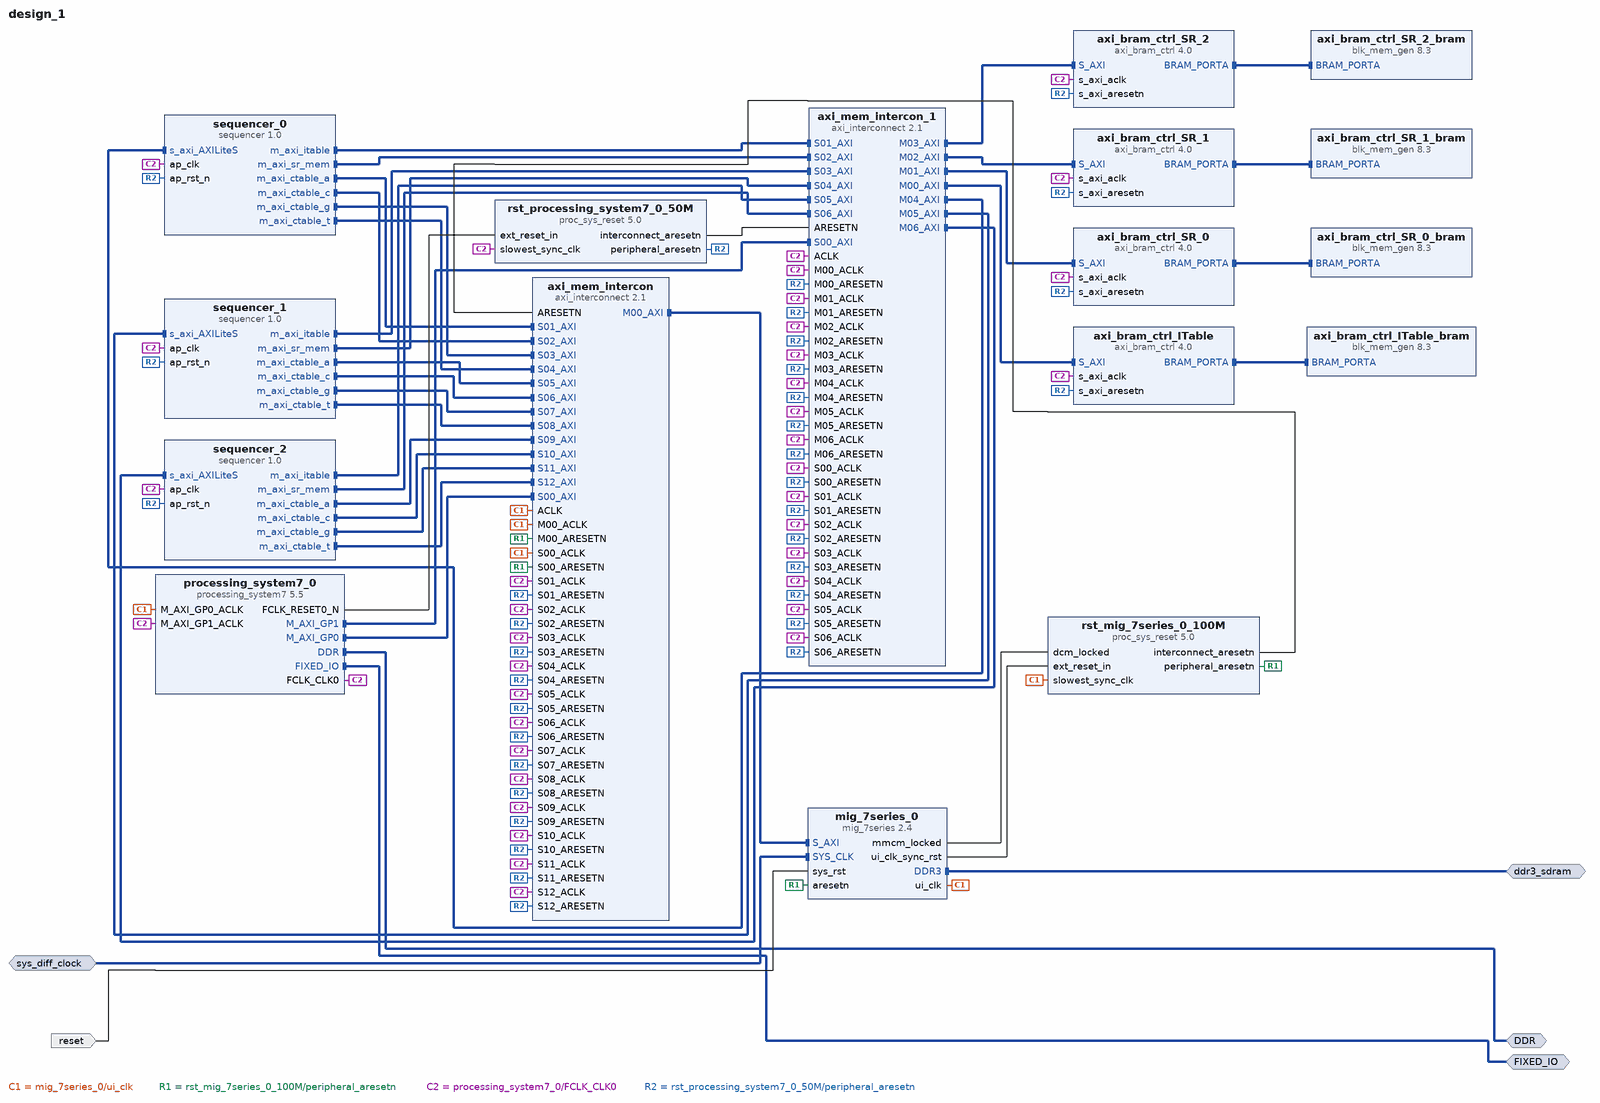
[diagram p0: block diagram of the top level]
# Vivado block design design_1, Vivado 2015.4
create_bd_design design_1

create_bd_intf_port -mode Master -vlnv xilinx.com:interface:ddrx_rtl:1.0 DDR
create_bd_intf_port -mode Master -vlnv xilinx.com:display_processing_system7:fixedio_rtl:1.0 FIXED_IO
create_bd_intf_port -mode Master -vlnv xilinx.com:interface:ddrx_rtl:1.0 ddr3_sdram
create_bd_intf_port -mode Slave -vlnv xilinx.com:interface:diff_clock_rtl:1.0 sys_diff_clock
set_property -dict {CONFIG.FREQ_HZ 100000000} [get_bd_intf_ports sys_diff_clock]
create_bd_port -dir I -type rst reset
set_property -dict {CONFIG.POLARITY ACTIVE_HIGH} [get_bd_ports reset]

create_bd_cell -type ip -vlnv xilinx.com:ip:processing_system7:5.5 processing_system7_0
set_property -dict [list \
  CONFIG.PCW_UIPARAM_DDR_FREQ_MHZ 533.333313 \
  CONFIG.PCW_APU_PERIPHERAL_FREQMHZ 667.000000 \
  CONFIG.PCW_SDIO_PERIPHERAL_FREQMHZ 50 \
  CONFIG.PCW_UART_PERIPHERAL_FREQMHZ 50 \
  CONFIG.PCW_USE_M_AXI_GP1 1 \
  CONFIG.PCW_PRESET_BANK0_VOLTAGE {LVCMOS 1.8V} \
  CONFIG.PCW_PRESET_BANK1_VOLTAGE {LVCMOS 1.8V} \
  CONFIG.PCW_UIPARAM_DDR_PARTNO Custom \
  CONFIG.PCW_QSPI_PERIPHERAL_ENABLE 1 \
  CONFIG.PCW_QSPI_GRP_SINGLE_SS_ENABLE 1 \
  CONFIG.PCW_QSPI_GRP_FBCLK_ENABLE 1 \
  CONFIG.PCW_ENET0_PERIPHERAL_ENABLE 1 \
  CONFIG.PCW_ENET0_ENET0_IO {MIO 16 .. 27} \
  CONFIG.PCW_ENET0_GRP_MDIO_ENABLE 1 \
  CONFIG.PCW_ENET0_GRP_MDIO_IO {MIO 52 .. 53} \
  CONFIG.PCW_ENET0_RESET_ENABLE 1 \
  CONFIG.PCW_ENET0_RESET_IO {MIO 47} \
  CONFIG.PCW_SD0_PERIPHERAL_ENABLE 1 \
  CONFIG.PCW_SD0_GRP_CD_ENABLE 1 \
  CONFIG.PCW_SD0_GRP_CD_IO {MIO 14} \
  CONFIG.PCW_SD0_GRP_WP_ENABLE 1 \
  CONFIG.PCW_UART1_PERIPHERAL_ENABLE 1 \
  CONFIG.PCW_WDT_PERIPHERAL_ENABLE 1 \
  CONFIG.PCW_TTC0_PERIPHERAL_ENABLE 1 \
  CONFIG.PCW_USB0_PERIPHERAL_ENABLE 1 \
  CONFIG.PCW_USB0_RESET_ENABLE 1 \
  CONFIG.PCW_USB0_RESET_IO {MIO 7} \
  CONFIG.PCW_I2C0_PERIPHERAL_ENABLE 1 \
  CONFIG.PCW_I2C0_I2C0_IO {MIO 50 .. 51} \
  CONFIG.PCW_I2C0_RESET_ENABLE 1 \
  CONFIG.PCW_I2C0_RESET_IO {MIO 46} \
  CONFIG.PCW_GPIO_MIO_GPIO_ENABLE 1 \
] [get_bd_cells processing_system7_0]
# 155 more settings of processing_system7_0 are not shown: defaults, MIO pin electricals, DDR timing, and values the tool derives
create_bd_cell -type ip -vlnv xilinx.com:ip:mig_7series:2.4 mig_7series_0
set_property -dict {CONFIG.RESET_BOARD_INTERFACE reset CONFIG.BOARD_MIG_PARAM ddr3_sdram} [get_bd_cells mig_7series_0]
create_bd_cell -type ip -vlnv xilinx.com:ip:axi_interconnect:2.1 axi_mem_intercon
set_property -dict {CONFIG.NUM_SI 13 CONFIG.NUM_MI 1} [get_bd_cells axi_mem_intercon]
create_bd_cell -type ip -vlnv xilinx.com:ip:proc_sys_reset:5.0 rst_mig_7series_0_100M
create_bd_cell -type ip -vlnv xilinx.com:ip:axi_bram_ctrl:4.0 axi_bram_ctrl_ITable
set_property -dict {CONFIG.SINGLE_PORT_BRAM 1} [get_bd_cells axi_bram_ctrl_ITable]
create_bd_cell -type ip -vlnv xilinx.com:ip:axi_interconnect:2.1 axi_mem_intercon_1
set_property -dict {CONFIG.NUM_SI 7 CONFIG.NUM_MI 7} [get_bd_cells axi_mem_intercon_1]
create_bd_cell -type ip -vlnv xilinx.com:ip:proc_sys_reset:5.0 rst_processing_system7_0_50M
create_bd_cell -type ip -vlnv xilinx.com:ip:blk_mem_gen:8.3 axi_bram_ctrl_ITable_bram
create_bd_cell -type ip -vlnv xilinx.com:ip:axi_bram_ctrl:4.0 axi_bram_ctrl_SR_0
set_property -dict {CONFIG.SINGLE_PORT_BRAM 1} [get_bd_cells axi_bram_ctrl_SR_0]
create_bd_cell -type ip -vlnv xilinx.com:ip:axi_bram_ctrl:4.0 axi_bram_ctrl_SR_1
set_property -dict {CONFIG.SINGLE_PORT_BRAM 1} [get_bd_cells axi_bram_ctrl_SR_1]
create_bd_cell -type ip -vlnv xilinx.com:ip:axi_bram_ctrl:4.0 axi_bram_ctrl_SR_2
set_property -dict {CONFIG.SINGLE_PORT_BRAM 1} [get_bd_cells axi_bram_ctrl_SR_2]
create_bd_cell -type ip -vlnv xilinx.com:ip:blk_mem_gen:8.3 axi_bram_ctrl_SR_0_bram
create_bd_cell -type ip -vlnv xilinx.com:ip:blk_mem_gen:8.3 axi_bram_ctrl_SR_1_bram
create_bd_cell -type ip -vlnv xilinx.com:ip:blk_mem_gen:8.3 axi_bram_ctrl_SR_2_bram
create_bd_cell -type ip -vlnv xilinx.com:hls:sequencer:1.0 sequencer_0
create_bd_cell -type ip -vlnv xilinx.com:hls:sequencer:1.0 sequencer_1
create_bd_cell -type ip -vlnv xilinx.com:hls:sequencer:1.0 sequencer_2

# ---- connections ----

connect_bd_intf_net [get_bd_intf_pins processing_system7_0/M_AXI_GP0] [get_bd_intf_pins axi_mem_intercon/S00_AXI]
connect_bd_intf_net [get_bd_intf_pins axi_mem_intercon/M00_AXI] [get_bd_intf_pins mig_7series_0/S_AXI]
connect_bd_intf_net [get_bd_intf_pins processing_system7_0/M_AXI_GP1] [get_bd_intf_pins axi_mem_intercon_1/S00_AXI]
connect_bd_intf_net [get_bd_intf_pins axi_mem_intercon_1/M00_AXI] [get_bd_intf_pins axi_bram_ctrl_ITable/S_AXI]
connect_bd_intf_net [get_bd_intf_pins axi_bram_ctrl_ITable_bram/BRAM_PORTA] [get_bd_intf_pins axi_bram_ctrl_ITable/BRAM_PORTA]
connect_bd_intf_net [get_bd_intf_pins axi_mem_intercon_1/M01_AXI] [get_bd_intf_pins axi_bram_ctrl_SR_0/S_AXI]
connect_bd_intf_net [get_bd_intf_pins axi_bram_ctrl_SR_0_bram/BRAM_PORTA] [get_bd_intf_pins axi_bram_ctrl_SR_0/BRAM_PORTA]
connect_bd_intf_net [get_bd_intf_pins axi_mem_intercon_1/M02_AXI] [get_bd_intf_pins axi_bram_ctrl_SR_1/S_AXI]
connect_bd_intf_net [get_bd_intf_pins axi_bram_ctrl_SR_1_bram/BRAM_PORTA] [get_bd_intf_pins axi_bram_ctrl_SR_1/BRAM_PORTA]
connect_bd_intf_net [get_bd_intf_pins axi_mem_intercon_1/M03_AXI] [get_bd_intf_pins axi_bram_ctrl_SR_2/S_AXI]
connect_bd_intf_net [get_bd_intf_pins axi_bram_ctrl_SR_2_bram/BRAM_PORTA] [get_bd_intf_pins axi_bram_ctrl_SR_2/BRAM_PORTA]
connect_bd_intf_net [get_bd_intf_pins sequencer_0/m_axi_ctable_a] [get_bd_intf_pins axi_mem_intercon/S01_AXI]
connect_bd_intf_net [get_bd_intf_pins sequencer_0/m_axi_ctable_c] [get_bd_intf_pins axi_mem_intercon/S02_AXI]
connect_bd_intf_net [get_bd_intf_pins sequencer_0/m_axi_ctable_g] [get_bd_intf_pins axi_mem_intercon/S03_AXI]
connect_bd_intf_net [get_bd_intf_pins sequencer_0/m_axi_ctable_t] [get_bd_intf_pins axi_mem_intercon/S04_AXI]
connect_bd_intf_net [get_bd_intf_pins sequencer_0/m_axi_itable] [get_bd_intf_pins axi_mem_intercon_1/S01_AXI]
connect_bd_intf_net [get_bd_intf_pins sequencer_0/m_axi_sr_mem] [get_bd_intf_pins axi_mem_intercon_1/S02_AXI]
connect_bd_intf_net [get_bd_intf_pins sequencer_1/m_axi_ctable_a] [get_bd_intf_pins axi_mem_intercon/S05_AXI]
connect_bd_intf_net [get_bd_intf_pins sequencer_1/m_axi_ctable_c] [get_bd_intf_pins axi_mem_intercon/S06_AXI]
connect_bd_intf_net [get_bd_intf_pins sequencer_1/m_axi_ctable_g] [get_bd_intf_pins axi_mem_intercon/S07_AXI]
connect_bd_intf_net [get_bd_intf_pins sequencer_1/m_axi_ctable_t] [get_bd_intf_pins axi_mem_intercon/S08_AXI]
connect_bd_intf_net [get_bd_intf_pins sequencer_1/m_axi_itable] [get_bd_intf_pins axi_mem_intercon_1/S03_AXI]
connect_bd_intf_net [get_bd_intf_pins sequencer_1/m_axi_sr_mem] [get_bd_intf_pins axi_mem_intercon_1/S04_AXI]
connect_bd_intf_net [get_bd_intf_pins sequencer_2/m_axi_ctable_a] [get_bd_intf_pins axi_mem_intercon/S09_AXI]
connect_bd_intf_net [get_bd_intf_pins sequencer_2/m_axi_ctable_c] [get_bd_intf_pins axi_mem_intercon/S10_AXI]
connect_bd_intf_net [get_bd_intf_pins sequencer_2/m_axi_ctable_g] [get_bd_intf_pins axi_mem_intercon/S11_AXI]
connect_bd_intf_net [get_bd_intf_pins sequencer_2/m_axi_ctable_t] [get_bd_intf_pins axi_mem_intercon/S12_AXI]
connect_bd_intf_net [get_bd_intf_pins sequencer_2/m_axi_itable] [get_bd_intf_pins axi_mem_intercon_1/S05_AXI]
connect_bd_intf_net [get_bd_intf_pins sequencer_2/m_axi_sr_mem] [get_bd_intf_pins axi_mem_intercon_1/S06_AXI]
connect_bd_intf_net [get_bd_intf_pins axi_mem_intercon_1/M04_AXI] [get_bd_intf_pins sequencer_0/s_axi_AXILiteS]
connect_bd_intf_net [get_bd_intf_pins axi_mem_intercon_1/M05_AXI] [get_bd_intf_pins sequencer_1/s_axi_AXILiteS]
connect_bd_intf_net [get_bd_intf_pins axi_mem_intercon_1/M06_AXI] [get_bd_intf_pins sequencer_2/s_axi_AXILiteS]
connect_bd_intf_net [get_bd_intf_ports DDR] [get_bd_intf_pins processing_system7_0/DDR]
connect_bd_intf_net [get_bd_intf_ports FIXED_IO] [get_bd_intf_pins processing_system7_0/FIXED_IO]
connect_bd_intf_net [get_bd_intf_ports ddr3_sdram] [get_bd_intf_pins mig_7series_0/DDR3]
connect_bd_intf_net [get_bd_intf_ports sys_diff_clock] [get_bd_intf_pins mig_7series_0/SYS_CLK]
connect_bd_net [get_bd_pins mig_7series_0/ui_clk] \
  [get_bd_pins processing_system7_0/M_AXI_GP0_ACLK] [get_bd_pins axi_mem_intercon/S00_ACLK] \
  [get_bd_pins rst_mig_7series_0_100M/slowest_sync_clk] [get_bd_pins axi_mem_intercon/ACLK] \
  [get_bd_pins axi_mem_intercon/M00_ACLK]
connect_bd_net [get_bd_pins mig_7series_0/mmcm_locked] [get_bd_pins rst_mig_7series_0_100M/dcm_locked]
connect_bd_net [get_bd_pins mig_7series_0/ui_clk_sync_rst] [get_bd_pins rst_mig_7series_0_100M/ext_reset_in]
connect_bd_net [get_bd_pins rst_mig_7series_0_100M/peripheral_aresetn] \
  [get_bd_pins axi_mem_intercon/S00_ARESETN] [get_bd_pins mig_7series_0/aresetn] [get_bd_pins axi_mem_intercon/M00_ARESETN]
connect_bd_net [get_bd_pins rst_mig_7series_0_100M/interconnect_aresetn] [get_bd_pins axi_mem_intercon/ARESETN]
connect_bd_net [get_bd_ports reset] [get_bd_pins mig_7series_0/sys_rst]
connect_bd_net [get_bd_pins processing_system7_0/FCLK_CLK0] \
  [get_bd_pins processing_system7_0/M_AXI_GP1_ACLK] [get_bd_pins axi_mem_intercon_1/S00_ACLK] \
  [get_bd_pins rst_processing_system7_0_50M/slowest_sync_clk] [get_bd_pins axi_mem_intercon_1/ACLK] \
  [get_bd_pins axi_bram_ctrl_ITable/s_axi_aclk] [get_bd_pins axi_mem_intercon_1/M00_ACLK] \
  [get_bd_pins axi_bram_ctrl_SR_0/s_axi_aclk] [get_bd_pins axi_mem_intercon_1/M01_ACLK] \
  [get_bd_pins axi_bram_ctrl_SR_1/s_axi_aclk] [get_bd_pins axi_mem_intercon_1/M02_ACLK] \
  [get_bd_pins axi_bram_ctrl_SR_2/s_axi_aclk] [get_bd_pins axi_mem_intercon_1/M03_ACLK] \
  [get_bd_pins axi_mem_intercon_1/M04_ACLK] [get_bd_pins sequencer_0/ap_clk] [get_bd_pins axi_mem_intercon_1/M05_ACLK] \
  [get_bd_pins axi_mem_intercon/S01_ACLK] [get_bd_pins axi_mem_intercon/S02_ACLK] [get_bd_pins axi_mem_intercon/S03_ACLK] \
  [get_bd_pins axi_mem_intercon/S04_ACLK] [get_bd_pins axi_mem_intercon_1/S01_ACLK] [get_bd_pins axi_mem_intercon_1/S02_ACLK] \
  [get_bd_pins sequencer_1/ap_clk] [get_bd_pins axi_mem_intercon_1/M06_ACLK] [get_bd_pins axi_mem_intercon/S05_ACLK] \
  [get_bd_pins axi_mem_intercon/S06_ACLK] [get_bd_pins axi_mem_intercon/S07_ACLK] [get_bd_pins axi_mem_intercon/S08_ACLK] \
  [get_bd_pins axi_mem_intercon_1/S03_ACLK] [get_bd_pins axi_mem_intercon_1/S04_ACLK] [get_bd_pins sequencer_2/ap_clk] \
  [get_bd_pins axi_mem_intercon/S09_ACLK] [get_bd_pins axi_mem_intercon/S10_ACLK] [get_bd_pins axi_mem_intercon/S11_ACLK] \
  [get_bd_pins axi_mem_intercon/S12_ACLK] [get_bd_pins axi_mem_intercon_1/S05_ACLK] [get_bd_pins axi_mem_intercon_1/S06_ACLK]
connect_bd_net [get_bd_pins processing_system7_0/FCLK_RESET0_N] [get_bd_pins rst_processing_system7_0_50M/ext_reset_in]
connect_bd_net [get_bd_pins rst_processing_system7_0_50M/peripheral_aresetn] \
  [get_bd_pins axi_mem_intercon_1/S00_ARESETN] [get_bd_pins axi_bram_ctrl_ITable/s_axi_aresetn] \
  [get_bd_pins axi_mem_intercon_1/M00_ARESETN] [get_bd_pins axi_bram_ctrl_SR_0/s_axi_aresetn] \
  [get_bd_pins axi_mem_intercon_1/M01_ARESETN] [get_bd_pins axi_bram_ctrl_SR_1/s_axi_aresetn] \
  [get_bd_pins axi_mem_intercon_1/M02_ARESETN] [get_bd_pins axi_bram_ctrl_SR_2/s_axi_aresetn] \
  [get_bd_pins axi_mem_intercon_1/M03_ARESETN] [get_bd_pins axi_mem_intercon_1/M04_ARESETN] \
  [get_bd_pins sequencer_0/ap_rst_n] [get_bd_pins axi_mem_intercon_1/M05_ARESETN] [get_bd_pins axi_mem_intercon/S01_ARESETN] \
  [get_bd_pins axi_mem_intercon/S02_ARESETN] [get_bd_pins axi_mem_intercon/S03_ARESETN] \
  [get_bd_pins axi_mem_intercon/S04_ARESETN] [get_bd_pins axi_mem_intercon_1/S01_ARESETN] \
  [get_bd_pins axi_mem_intercon_1/S02_ARESETN] [get_bd_pins sequencer_1/ap_rst_n] \
  [get_bd_pins axi_mem_intercon_1/M06_ARESETN] [get_bd_pins axi_mem_intercon/S05_ARESETN] \
  [get_bd_pins axi_mem_intercon/S06_ARESETN] [get_bd_pins axi_mem_intercon/S07_ARESETN] \
  [get_bd_pins axi_mem_intercon/S08_ARESETN] [get_bd_pins axi_mem_intercon_1/S03_ARESETN] \
  [get_bd_pins axi_mem_intercon_1/S04_ARESETN] [get_bd_pins sequencer_2/ap_rst_n] [get_bd_pins axi_mem_intercon/S09_ARESETN] \
  [get_bd_pins axi_mem_intercon/S10_ARESETN] [get_bd_pins axi_mem_intercon/S11_ARESETN] \
  [get_bd_pins axi_mem_intercon/S12_ARESETN] [get_bd_pins axi_mem_intercon_1/S05_ARESETN] \
  [get_bd_pins axi_mem_intercon_1/S06_ARESETN]
connect_bd_net [get_bd_pins rst_processing_system7_0_50M/interconnect_aresetn] [get_bd_pins axi_mem_intercon_1/ARESETN]

# ---- address map ----
assign_bd_address -offset 0x40000000 -range 1G -target_address_space [get_bd_addr_spaces processing_system7_0/Data] [get_bd_addr_segs mig_7series_0/memmap/memaddr]
assign_bd_address -offset 0x80000000 -range 8K -target_address_space [get_bd_addr_spaces processing_system7_0/Data] [get_bd_addr_segs axi_bram_ctrl_ITable/S_AXI/Mem0]
assign_bd_address -offset 0x82000000 -range 8K -target_address_space [get_bd_addr_spaces processing_system7_0/Data] [get_bd_addr_segs axi_bram_ctrl_SR_0/S_AXI/Mem0]
assign_bd_address -offset 0x83C00000 -range 64K -target_address_space [get_bd_addr_spaces processing_system7_0/Data] [get_bd_addr_segs sequencer_0/s_axi_AXILiteS/Reg]
assign_bd_address -offset 0x83C10000 -range 64K -target_address_space [get_bd_addr_spaces processing_system7_0/Data] [get_bd_addr_segs sequencer_1/s_axi_AXILiteS/Reg]
assign_bd_address -offset 0x83C20000 -range 64K -target_address_space [get_bd_addr_spaces processing_system7_0/Data] [get_bd_addr_segs sequencer_2/s_axi_AXILiteS/Reg]
assign_bd_address -offset 0x84000000 -range 8K -target_address_space [get_bd_addr_spaces processing_system7_0/Data] [get_bd_addr_segs axi_bram_ctrl_SR_1/S_AXI/Mem0]
assign_bd_address -offset 0x86000000 -range 8K -target_address_space [get_bd_addr_spaces processing_system7_0/Data] [get_bd_addr_segs axi_bram_ctrl_SR_2/S_AXI/Mem0]
assign_bd_address -offset 0x40000000 -range 1G -target_address_space [get_bd_addr_spaces sequencer_0/Data_m_axi_ctable_a] [get_bd_addr_segs mig_7series_0/memmap/memaddr]
assign_bd_address -offset 0x40000000 -range 1G -target_address_space [get_bd_addr_spaces sequencer_0/Data_m_axi_ctable_c] [get_bd_addr_segs mig_7series_0/memmap/memaddr]
assign_bd_address -offset 0x40000000 -range 1G -target_address_space [get_bd_addr_spaces sequencer_0/Data_m_axi_ctable_g] [get_bd_addr_segs mig_7series_0/memmap/memaddr]
assign_bd_address -offset 0x40000000 -range 1G -target_address_space [get_bd_addr_spaces sequencer_0/Data_m_axi_ctable_t] [get_bd_addr_segs mig_7series_0/memmap/memaddr]
assign_bd_address -offset 0x80000000 -range 8K -target_address_space [get_bd_addr_spaces sequencer_0/Data_m_axi_itable] [get_bd_addr_segs axi_bram_ctrl_ITable/S_AXI/Mem0]
assign_bd_address -offset 0x82000000 -range 8K -target_address_space [get_bd_addr_spaces sequencer_0/Data_m_axi_itable] [get_bd_addr_segs axi_bram_ctrl_SR_0/S_AXI/Mem0]
assign_bd_address -offset 0x84000000 -range 8K -target_address_space [get_bd_addr_spaces sequencer_0/Data_m_axi_itable] [get_bd_addr_segs axi_bram_ctrl_SR_1/S_AXI/Mem0]
assign_bd_address -offset 0x86000000 -range 8K -target_address_space [get_bd_addr_spaces sequencer_0/Data_m_axi_itable] [get_bd_addr_segs axi_bram_ctrl_SR_2/S_AXI/Mem0]
exclude_bd_addr_seg -offset 0x83C00000 -range 64K -target_address_space [get_bd_addr_spaces sequencer_0/Data_m_axi_itable] [get_bd_addr_segs sequencer_0/s_axi_AXILiteS/Reg]
exclude_bd_addr_seg -offset 0x83C10000 -range 64K -target_address_space [get_bd_addr_spaces sequencer_0/Data_m_axi_itable] [get_bd_addr_segs sequencer_1/s_axi_AXILiteS/Reg]
exclude_bd_addr_seg -offset 0x83C20000 -range 64K -target_address_space [get_bd_addr_spaces sequencer_0/Data_m_axi_itable] [get_bd_addr_segs sequencer_2/s_axi_AXILiteS/Reg]
assign_bd_address -offset 0x80000000 -range 8K -target_address_space [get_bd_addr_spaces sequencer_0/Data_m_axi_sr_mem] [get_bd_addr_segs axi_bram_ctrl_ITable/S_AXI/Mem0]
assign_bd_address -offset 0x82000000 -range 8K -target_address_space [get_bd_addr_spaces sequencer_0/Data_m_axi_sr_mem] [get_bd_addr_segs axi_bram_ctrl_SR_0/S_AXI/Mem0]
assign_bd_address -offset 0x84000000 -range 8K -target_address_space [get_bd_addr_spaces sequencer_0/Data_m_axi_sr_mem] [get_bd_addr_segs axi_bram_ctrl_SR_1/S_AXI/Mem0]
assign_bd_address -offset 0x86000000 -range 8K -target_address_space [get_bd_addr_spaces sequencer_0/Data_m_axi_sr_mem] [get_bd_addr_segs axi_bram_ctrl_SR_2/S_AXI/Mem0]
exclude_bd_addr_seg -offset 0x83C00000 -range 64K -target_address_space [get_bd_addr_spaces sequencer_0/Data_m_axi_sr_mem] [get_bd_addr_segs sequencer_0/s_axi_AXILiteS/Reg]
exclude_bd_addr_seg -offset 0x83C10000 -range 64K -target_address_space [get_bd_addr_spaces sequencer_0/Data_m_axi_sr_mem] [get_bd_addr_segs sequencer_1/s_axi_AXILiteS/Reg]
exclude_bd_addr_seg -offset 0x83C20000 -range 64K -target_address_space [get_bd_addr_spaces sequencer_0/Data_m_axi_sr_mem] [get_bd_addr_segs sequencer_2/s_axi_AXILiteS/Reg]
assign_bd_address -offset 0x40000000 -range 1G -target_address_space [get_bd_addr_spaces sequencer_1/Data_m_axi_ctable_a] [get_bd_addr_segs mig_7series_0/memmap/memaddr]
assign_bd_address -offset 0x40000000 -range 1G -target_address_space [get_bd_addr_spaces sequencer_1/Data_m_axi_ctable_c] [get_bd_addr_segs mig_7series_0/memmap/memaddr]
assign_bd_address -offset 0x40000000 -range 1G -target_address_space [get_bd_addr_spaces sequencer_1/Data_m_axi_ctable_g] [get_bd_addr_segs mig_7series_0/memmap/memaddr]
assign_bd_address -offset 0x40000000 -range 1G -target_address_space [get_bd_addr_spaces sequencer_1/Data_m_axi_ctable_t] [get_bd_addr_segs mig_7series_0/memmap/memaddr]
assign_bd_address -offset 0x80000000 -range 8K -target_address_space [get_bd_addr_spaces sequencer_1/Data_m_axi_itable] [get_bd_addr_segs axi_bram_ctrl_ITable/S_AXI/Mem0]
assign_bd_address -offset 0x82000000 -range 8K -target_address_space [get_bd_addr_spaces sequencer_1/Data_m_axi_itable] [get_bd_addr_segs axi_bram_ctrl_SR_0/S_AXI/Mem0]
assign_bd_address -offset 0x84000000 -range 8K -target_address_space [get_bd_addr_spaces sequencer_1/Data_m_axi_itable] [get_bd_addr_segs axi_bram_ctrl_SR_1/S_AXI/Mem0]
assign_bd_address -offset 0x86000000 -range 8K -target_address_space [get_bd_addr_spaces sequencer_1/Data_m_axi_itable] [get_bd_addr_segs axi_bram_ctrl_SR_2/S_AXI/Mem0]
exclude_bd_addr_seg -offset 0x83C00000 -range 64K -target_address_space [get_bd_addr_spaces sequencer_1/Data_m_axi_itable] [get_bd_addr_segs sequencer_0/s_axi_AXILiteS/Reg]
exclude_bd_addr_seg -offset 0x83C10000 -range 64K -target_address_space [get_bd_addr_spaces sequencer_1/Data_m_axi_itable] [get_bd_addr_segs sequencer_1/s_axi_AXILiteS/Reg]
exclude_bd_addr_seg -offset 0x83C20000 -range 64K -target_address_space [get_bd_addr_spaces sequencer_1/Data_m_axi_itable] [get_bd_addr_segs sequencer_2/s_axi_AXILiteS/Reg]
assign_bd_address -offset 0x80000000 -range 8K -target_address_space [get_bd_addr_spaces sequencer_1/Data_m_axi_sr_mem] [get_bd_addr_segs axi_bram_ctrl_ITable/S_AXI/Mem0]
assign_bd_address -offset 0x82000000 -range 8K -target_address_space [get_bd_addr_spaces sequencer_1/Data_m_axi_sr_mem] [get_bd_addr_segs axi_bram_ctrl_SR_0/S_AXI/Mem0]
assign_bd_address -offset 0x84000000 -range 8K -target_address_space [get_bd_addr_spaces sequencer_1/Data_m_axi_sr_mem] [get_bd_addr_segs axi_bram_ctrl_SR_1/S_AXI/Mem0]
assign_bd_address -offset 0x86000000 -range 8K -target_address_space [get_bd_addr_spaces sequencer_1/Data_m_axi_sr_mem] [get_bd_addr_segs axi_bram_ctrl_SR_2/S_AXI/Mem0]
exclude_bd_addr_seg -offset 0x83C00000 -range 64K -target_address_space [get_bd_addr_spaces sequencer_1/Data_m_axi_sr_mem] [get_bd_addr_segs sequencer_0/s_axi_AXILiteS/Reg]
exclude_bd_addr_seg -offset 0x83C10000 -range 64K -target_address_space [get_bd_addr_spaces sequencer_1/Data_m_axi_sr_mem] [get_bd_addr_segs sequencer_1/s_axi_AXILiteS/Reg]
exclude_bd_addr_seg -offset 0x83C20000 -range 64K -target_address_space [get_bd_addr_spaces sequencer_1/Data_m_axi_sr_mem] [get_bd_addr_segs sequencer_2/s_axi_AXILiteS/Reg]
assign_bd_address -offset 0x40000000 -range 1G -target_address_space [get_bd_addr_spaces sequencer_2/Data_m_axi_ctable_a] [get_bd_addr_segs mig_7series_0/memmap/memaddr]
assign_bd_address -offset 0x40000000 -range 1G -target_address_space [get_bd_addr_spaces sequencer_2/Data_m_axi_ctable_c] [get_bd_addr_segs mig_7series_0/memmap/memaddr]
assign_bd_address -offset 0x40000000 -range 1G -target_address_space [get_bd_addr_spaces sequencer_2/Data_m_axi_ctable_g] [get_bd_addr_segs mig_7series_0/memmap/memaddr]
assign_bd_address -offset 0x40000000 -range 1G -target_address_space [get_bd_addr_spaces sequencer_2/Data_m_axi_ctable_t] [get_bd_addr_segs mig_7series_0/memmap/memaddr]
assign_bd_address -offset 0x80000000 -range 8K -target_address_space [get_bd_addr_spaces sequencer_2/Data_m_axi_itable] [get_bd_addr_segs axi_bram_ctrl_ITable/S_AXI/Mem0]
assign_bd_address -offset 0x82000000 -range 8K -target_address_space [get_bd_addr_spaces sequencer_2/Data_m_axi_itable] [get_bd_addr_segs axi_bram_ctrl_SR_0/S_AXI/Mem0]
assign_bd_address -offset 0x84000000 -range 8K -target_address_space [get_bd_addr_spaces sequencer_2/Data_m_axi_itable] [get_bd_addr_segs axi_bram_ctrl_SR_1/S_AXI/Mem0]
assign_bd_address -offset 0x86000000 -range 8K -target_address_space [get_bd_addr_spaces sequencer_2/Data_m_axi_itable] [get_bd_addr_segs axi_bram_ctrl_SR_2/S_AXI/Mem0]
exclude_bd_addr_seg -offset 0x83C00000 -range 64K -target_address_space [get_bd_addr_spaces sequencer_2/Data_m_axi_itable] [get_bd_addr_segs sequencer_0/s_axi_AXILiteS/Reg]
exclude_bd_addr_seg -offset 0x83C10000 -range 64K -target_address_space [get_bd_addr_spaces sequencer_2/Data_m_axi_itable] [get_bd_addr_segs sequencer_1/s_axi_AXILiteS/Reg]
exclude_bd_addr_seg -offset 0x83C20000 -range 64K -target_address_space [get_bd_addr_spaces sequencer_2/Data_m_axi_itable] [get_bd_addr_segs sequencer_2/s_axi_AXILiteS/Reg]
assign_bd_address -offset 0x80000000 -range 8K -target_address_space [get_bd_addr_spaces sequencer_2/Data_m_axi_sr_mem] [get_bd_addr_segs axi_bram_ctrl_ITable/S_AXI/Mem0]
assign_bd_address -offset 0x82000000 -range 8K -target_address_space [get_bd_addr_spaces sequencer_2/Data_m_axi_sr_mem] [get_bd_addr_segs axi_bram_ctrl_SR_0/S_AXI/Mem0]
assign_bd_address -offset 0x84000000 -range 8K -target_address_space [get_bd_addr_spaces sequencer_2/Data_m_axi_sr_mem] [get_bd_addr_segs axi_bram_ctrl_SR_1/S_AXI/Mem0]
assign_bd_address -offset 0x86000000 -range 8K -target_address_space [get_bd_addr_spaces sequencer_2/Data_m_axi_sr_mem] [get_bd_addr_segs axi_bram_ctrl_SR_2/S_AXI/Mem0]
exclude_bd_addr_seg -offset 0x83C00000 -range 64K -target_address_space [get_bd_addr_spaces sequencer_2/Data_m_axi_sr_mem] [get_bd_addr_segs sequencer_0/s_axi_AXILiteS/Reg]
exclude_bd_addr_seg -offset 0x83C10000 -range 64K -target_address_space [get_bd_addr_spaces sequencer_2/Data_m_axi_sr_mem] [get_bd_addr_segs sequencer_1/s_axi_AXILiteS/Reg]
exclude_bd_addr_seg -offset 0x83C20000 -range 64K -target_address_space [get_bd_addr_spaces sequencer_2/Data_m_axi_sr_mem] [get_bd_addr_segs sequencer_2/s_axi_AXILiteS/Reg]

validate_bd_design
save_bd_design
